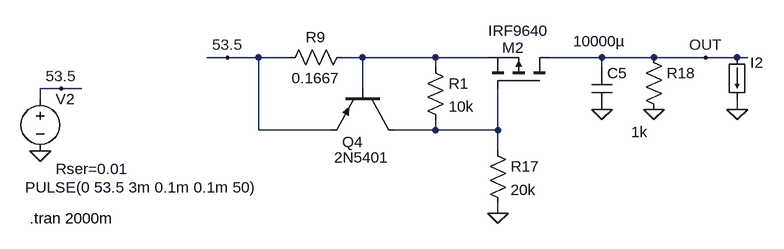
[diagram p0: schematic Cap_Charger_2.asc]
Cap_Charger_2.asc, the LTspice schematic file:
Version 4
SHEET 1 2652 680
WIRE 112 80 80 80
WIRE 160 80 112 80
WIRE 208 80 160 80
WIRE 320 80 288 80
WIRE 432 80 320 80
WIRE 512 80 432 80
WIRE 688 80 608 80
WIRE 768 80 688 80
WIRE 848 80 768 80
WIRE 896 80 848 80
WIRE 912 80 896 80
WIRE 432 96 432 80
WIRE 688 96 688 80
WIRE -144 128 -176 128
WIRE -112 128 -144 128
WIRE 320 128 320 80
WIRE -176 144 -176 128
WIRE 896 160 896 144
WIRE 160 192 160 80
WIRE 272 192 160 192
WIRE 432 192 432 176
WIRE 432 192 368 192
WIRE 528 192 528 128
WIRE 528 192 432 192
WIRE 528 224 528 192
WIRE 528 320 528 304
FLAG 112 80 53.5
FLAG -176 224 0
FLAG -144 128 53.5
FLAG 688 160 0
FLAG 768 160 0
FLAG 896 160 0
FLAG 848 80 OUT
FLAG 528 320 0
SYMBOL pmos 608 128 M270
WINDOW 0 63 73 VLeft 2
WINDOW 3 89 95 VLeft 2
SYMATTR InstName M2
SYMATTR Value IRF9640
SYMBOL res 192 96 R270
WINDOW 0 32 56 VTop 2
WINDOW 3 0 56 VBottom 2
SYMATTR InstName R9
SYMATTR Value 0.1667
SYMBOL voltage -176 128 R0
WINDOW 3 -23 152 Left 2
WINDOW 123 0 0 Left 0
WINDOW 39 24 124 Left 2
SYMATTR Value PULSE(0 53.5 3m 0.1m 0.1m 50)
SYMATTR SpiceLine Rser=0.01
SYMATTR InstName V2
SYMBOL pnp 368 128 R90
WINDOW 0 82 47 VRight 2
WINDOW 3 106 7 VRight 2
SYMATTR InstName Q4
SYMATTR Value 2N5401
SYMBOL res 512 208 R0
SYMATTR InstName R17
SYMATTR Value 20k
SYMBOL cap 672 96 R0
WINDOW 3 -28 -41 Left 2
SYMATTR Value 10000µ
SYMATTR InstName C5
SYMATTR SpiceLine V=100 Rser=.1
SYMBOL res 752 64 R0
WINDOW 3 -19 131 Left 2
SYMATTR Value 1k
SYMATTR InstName R18
SYMBOL load 880 80 R0
WINDOW 3 -128 152 Invisible 2
WINDOW 123 0 0 Left 0
WINDOW 39 0 0 Left 0
SYMATTR Value PULSE(0.1 12 0.75 0.005 0.005 0.005 0.2)
SYMATTR InstName I2
SYMBOL res 416 80 R0
SYMATTR InstName R1
SYMATTR Value 10k
TEXT -192 328 Left 2 !.tran 2000m

The netlist it stands for:
* Cap_Charger_2.asc
M2 OUT N002 N001 N001 IRF9640
R9 53.5 N001 0.1667
V2 53.5 0 PULSE(0 53.5 3m 0.1m 0.1m 50) Rser=0.01
Q4 N002 N001 53.5 0 2N5401
R17 N002 0 20k
C5 OUT 0 10000µ V=100 Rser=.1
R18 OUT 0 1k
I2 OUT 0 PULSE(0.1 12 0.75 0.005 0.005 0.005 0.2)
R1 N001 N002 10k
.model NPN NPN
.model PNP PNP
.lib standard.bjt
.model NMOS NMOS
.model PMOS PMOS
.lib standard.mos
.tran 2000m
.backanno
.end